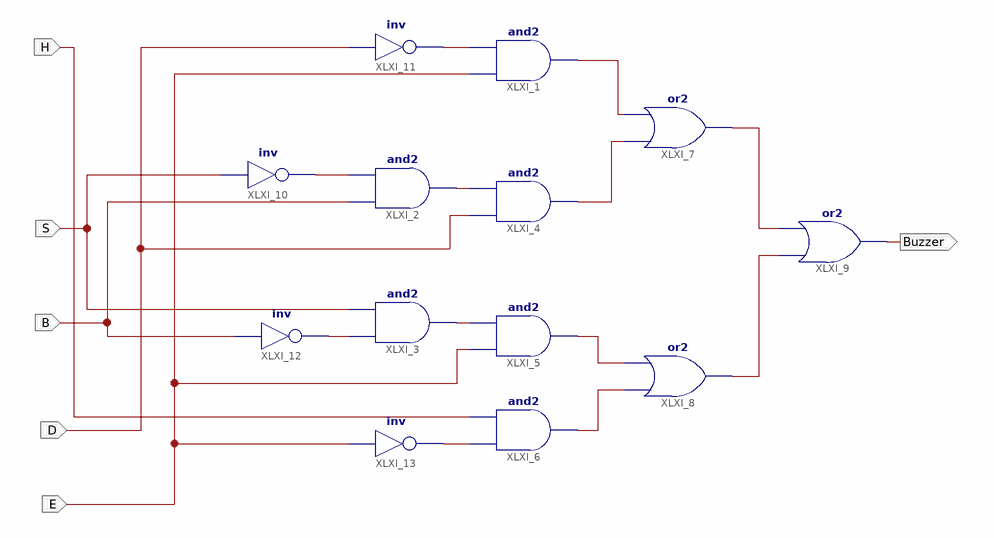
[diagram p0: schematic sheet 1]
// Xilinx ISE schematic lab4.sch (spartan6) as structural Verilog: 13 symbols, 6 ports
module lab4 (
  input  H,
  input  S,
  input  B,
  input  E,
  input  D,
  output Buzzer
);

  wire XLXN_1, XLXN_8, XLXN_9, XLXN_10, XLXN_11, XLXN_12, XLXN_13, XLXN_14, XLXN_15, XLXN_16, XLXN_17,
       XLXN_18;

  and XLXI_1 (XLXN_1, E, XLXN_11);
  and XLXI_2 (XLXN_9, B, XLXN_10);
  and XLXI_3 (XLXN_18, XLXN_12, S);
  and XLXI_4 (XLXN_8, D, XLXN_9);
  and XLXI_5 (XLXN_16, E, XLXN_18);
  and XLXI_6 (XLXN_17, XLXN_13, H);
  or XLXI_7 (XLXN_14, XLXN_8, XLXN_1);
  or XLXI_8 (XLXN_15, XLXN_17, XLXN_16);
  or XLXI_9 (Buzzer, XLXN_15, XLXN_14);
  not XLXI_10 (XLXN_10, S);
  not XLXI_11 (XLXN_11, D);
  not XLXI_12 (XLXN_12, B);
  not XLXI_13 (XLXN_13, E);
endmodule
